# EAGLE design axiom_beta_center_solder_on_v0.1 (EAGLE 7.0.0)
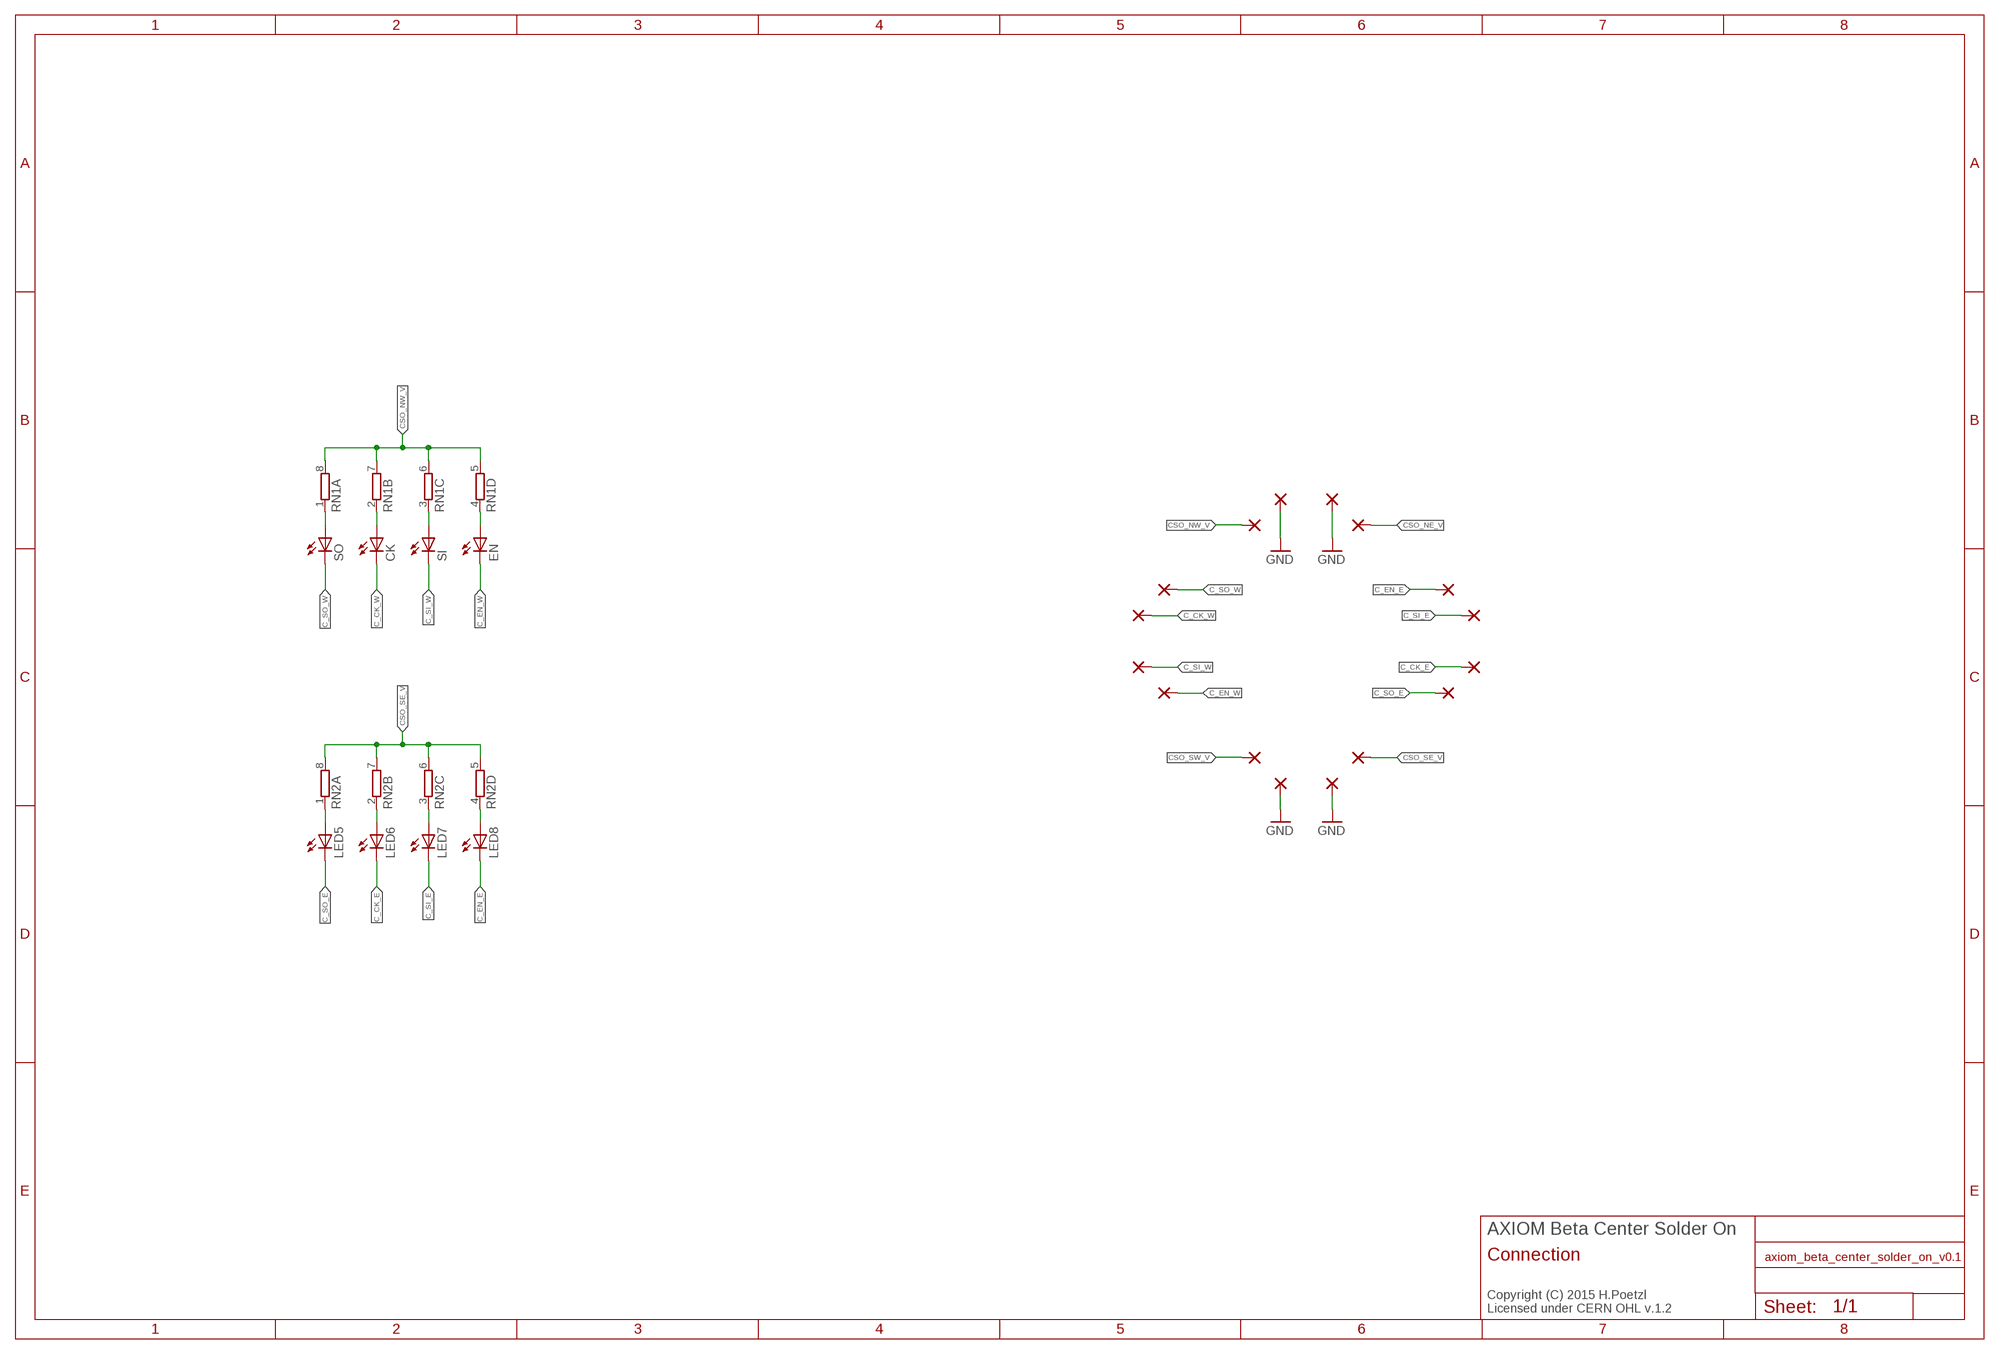
[diagram p0: schematic, sheet 1]

## Parts
CK  LEDCHIPLED_0603  [CHIPLED_0603]
EN  LEDCHIPLED_0603  [CHIPLED_0603]
LED5  LEDCHIPLED_0603  [CHIPLED_0603]
LED6  LEDCHIPLED_0603  [CHIPLED_0603]
LED7  LEDCHIPLED_0603  [CHIPLED_0603]
LED8  LEDCHIPLED_0603  [CHIPLED_0603]
RN1  4R-NCAT16  [CAT16]
RN2  4R-NCAT16  [CAT16]
SI  LEDCHIPLED_0603  [CHIPLED_0603]
SO  LEDCHIPLED_0603  [CHIPLED_0603]
U$1  PINPAD2.00MM  [1.4/0.8]
U$2  PINPAD2.00MM  [1.4/0.8]
U$3  PINPAD2.00MM  [1.4/0.8]
U$4  PINPAD2.00MM  [1.4/0.8]
U$5  PINPAD2.00MM  [1.4/0.8]
U$6  PINPAD2.00MM  [1.4/0.8]
U$11  PINPAD2.00MM  [1.4/0.8]
U$14  PINPAD2.00MM  [1.4/0.8]
U$15  PINPAD2.00MM  [1.4/0.8]
U$16  PINPAD2.00MM  [1.4/0.8]
U$17  PINPAD2.00MM  [1.4/0.8]
U$18  PINPAD2.00MM  [1.4/0.8]
U$19  PINPAD2.00MM  [1.4/0.8]
U$20  PINPAD2.00MM  [1.4/0.8]
U$21  PINPAD2.00MM  [1.4/0.8]
U$22  PINPAD2.00MM  [1.4/0.8]

## Nets
C_CK_E: LED6.C U$14.1(P)
C_CK_W: CK.C U$1.1(P)
C_EN_E: LED8.C U$3.1(P)
C_EN_W: EN.C U$4.1(P)
C_SI_E: LED7.C U$15.1(P)
C_SI_W: SI.C U$2.1(P)
C_SO_E: LED5.C U$16.1(P)
C_SO_W: SO.C U$11.1(P)
CSO_NE_V [power]: U$19.1(P)
CSO_NW_V: RN1.5 RN1.6 RN1.7 RN1.8 U$18.1(P)
CSO_SE_V: RN2.5 RN2.6 RN2.7 RN2.8 U$21.1(P)
CSO_SW_V [power]: U$22.1(P)
GND: U$5.1(P) U$6.1(P) U$17.1(P) U$20.1(P)
N$1: RN1.1 SO.A
N$5: CK.A RN1.2
N$6: RN1.3 SI.A
N$7: EN.A RN1.4
N$14: LED5.A RN2.1
N$15: LED6.A RN2.2
N$16: LED7.A RN2.3
N$17: LED8.A RN2.4

## Notes on the sheet
- AXIOM Beta Center Solder On
- Connection
- Copyright (C) 2015 H.Poetzl
  Licensed under CERN OHL v.1.2

## Library data of the parts
CK EN LED5-LED8 SI SO = led:LED: LED OSRAM: - CHIPLED LG R971, LG N971, LY N971, LG Q971, LY Q971, LO R971, LY R971 LH N974, LH R974 LS Q976, LO Q976, LY Q976 LO Q996 - Hyper CHIPLED LW Q18S LB Q993, LB Q99A, LB R99A - SideLED LS A670, LO A670, LY A670, LG A670, LP A670 LB A673, LV A673, LT A673, LW A673 LH A674 LY A675 LS A676, LA A676, LO A676, LY A676, LW A676 LS A679, LY A679, LG A679 - Hyper Micro SIDELED® LS Y876, LA Y876, LO Y876, LY Y876 LT Y87S - SmartLED LW L88C, LW L88S LB L89C, LB L89S, LG L890 LS L89K, LO L89K, LY L89K LS L896, LA L896, LO L896, LY L896 - TOPLED LS T670, LO T670, LY T670, LG T670, LP T670 LSG T670, LSP T670, LSY T670, LOP T670, LYG T670 LG T671, LOG T671, LSG T671 LB T673, LV T673, LT T673, LW T673 LH T674 LS T676, LA T676, LO T676, LY T676, LB T676, LH T676, LSB T676, LW T676 LB T67C, LV T67C, LT T67C, LS T67K, LO T67K, LY T67K, LW E67C LS E67B, LA E67B, LO E67B, LY E67B, LB E67C, LV E67C, LT E67C LW T67C LS T679, LY T679, LG T679 LS T770, LO T770, LY T770, LG T770, LP T770 LB T773, LV T773, LT T773, LW T773 LH T774 LS E675, LA E675, LY E675, LS T675 LS T776, LA T776, LO T776, LY T776, LB T776 LHGB T686 LT T68C, LB T68C - Hyper Mini TOPLED® LB M676 - Mini TOPLED Santana® LG M470 LS M47K, LO M47K, LY M47K Source: http://www.osram.convergy.de LUXEON: - LUMILED® LXK2-PW12-R00, LXK2-PW12-S00, LXK2-PW14-U00, LXK2-PW14-V00 LXK2-PM12-R00, LXK2-PM12-S00, LXK2-PM14-U00 LXK2-PE12-Q00, LXK2-PE12-R00, LXK2-PE12-S00, LXK2-PE14-T00, LXK2-PE14-U00 LXK2-PB12-K00, LXK2-PB12-L00, LXK2-PB12-M00, LXK2-PB14-N00, LXK2-PB14-P00, LXK2-PB14-Q00 LXK2-PR12-L00, LXK2-PR12-M00, LXK2-PR14-Q00, LXK2-PR14-R00 LXK2-PD12-Q00, LXK2-PD12-R00, LXK2-PD12-S00 LXK2-PH12-R00, LXK2-PH12-S00 LXK2-PL12-P00, LXK2-PL12-Q00, LXK2-PL12-R00 Source: www.luxeon.com KINGBRIGHT: KA-3528ASYC Source: www.kingbright.com
RN1 RN2 = resistor-dil:4R-N: Array Chip Resistor Source: RS Component / Phycomp; OC_FARNELL: unknown; OC_NEWARK: unknown
U$1-U$6 U$11 U$14-U$22 = pinpad:PINPAD

## Net classes
0 default: width 0.152 mm, drill 0.254 mm
1 power: width 0.152 mm, drill 0.254 mm

## Board
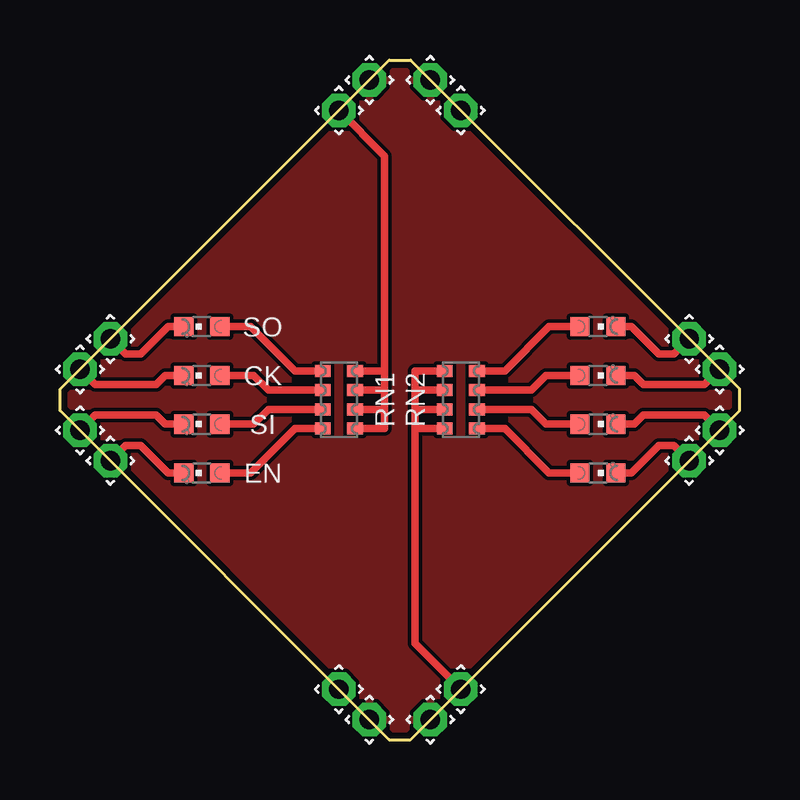
[diagram p1: board, top side]
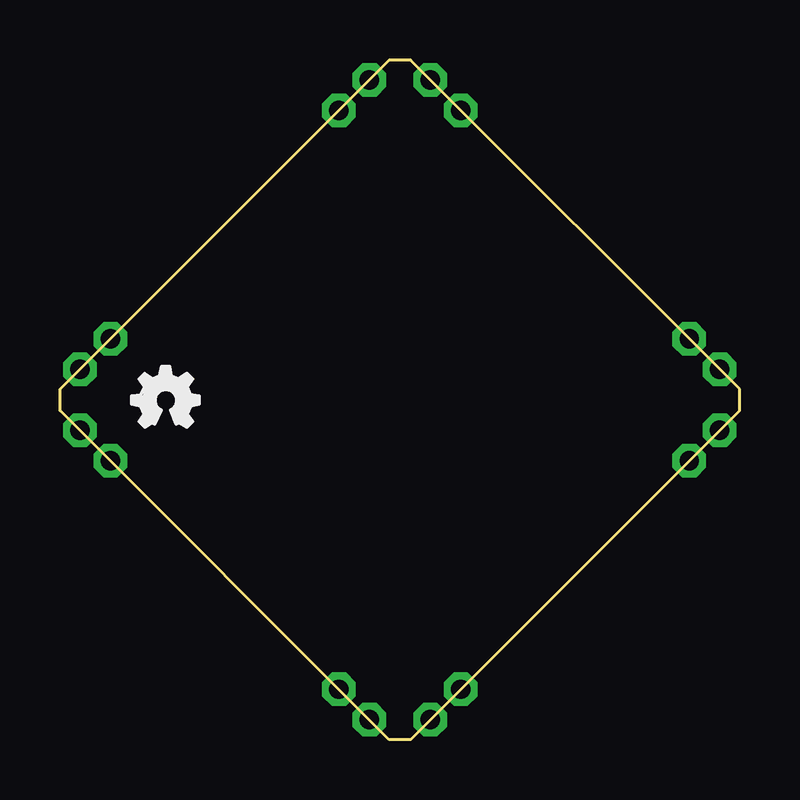
[diagram p2: board, bottom side, seen from below]

Size 28.34 x 28.34 mm. Coordinates in mm from the lower left corner, seen from the top.
Outline: 0,13.72 13.72,0 14.62,0 28.34,13.72 28.34,14.62 14.62,28.34 13.72,28.34 0,14.62 0,13.72
Copper layers (1*2*15*16): Top 0.035559375mm / dielectric 0.17018125mm / Route2 0.01778125mm / dielectric 47mil / Route15 0.01778125mm / dielectric 0.17018125mm / Bottom 0.035559375mm
Design rules "OSHPark-4layer-tuned *": minimum track width 5mil, minimum drill 10mil, track to track 6mil, track to pad 5mil, pad to pad 5mil, via to via 5mil, smd to smd 5mil, copper to edge 10mil, drill to drill 6mil, minimum pad ring 4mil, minimum via ring 4mil, stop-mask expansion 2mil, vias tented up to drill 100mil, thermal gap 6mil

### Footprints (pad centres in the part's own frame; a part is rotated, then mirrored left to right if it is on the bottom)
CHIPLED_0603 = smd 0.8 x 0.8: A 0,-0.75; C 0,0.75
CAT16 = smd 0.5 x 0.65: 1 -1.2,-0.675; 2 -0.4,-0.675; 3 0.4,-0.675; 4 1.2,-0.675; 5 1.2,0.675; 6 0.4,0.675; 7 -0.4,0.675; 8 -1.2,0.675
1.4/0.8 = drill 0.8 pad 1.4 octagon: 1 0,0

### Placement (x,y rotation side)
CK  5.91,15.18 90 top
EN  5.91,11.12 90 top
LED5  22.42,11.12 270 top
LED6  22.42,13.15 270 top
LED7  22.42,15.18 270 top
LED8  22.42,17.22 270 top
LOGO1  OSHW_LOGO_FILLX0100-NT  [OSHW_FILLX100_NOTEXT]  25.34,13.03 0 bottom
RN1  11.63,14.17 270 top
RN2  16.71,14.17 90 top
SI  5.91,13.15 90 top
SO  5.91,17.22 90 top
U$1  0.83,15.44 45 top
U$2  0.83,12.9 45 top
U$3  26.23,16.71 45 top
U$4  2.1,11.63 225 top
U$5  15.44,0.83 45 top
U$6  15.44,27.5 45 top
U$11  2.1,16.71 45 top
U$14  27.5,12.9 45 top
U$15  27.5,15.44 45 top
U$16  26.23,11.63 45 top
U$17  12.9,27.5 45 top
U$18  11.63,26.23 45 top
U$19  16.71,26.23 45 top
U$20  12.9,0.83 45 top
U$21  16.71,2.1 45 top
U$22  11.63,2.1 45 top

### Tracks (layer width: path | path; a pad name or v marks a point on that pad's centre or on a via)
C_CK_E
  Top 0.305: U$14.1 26.87,13.53 24.33,13.53 23.95,13.15 LED6.C
C_CK_W
  Top 0.305: U$1.1 1.47,14.8 4.01,14.8 4.39,15.18 CK.C
C_EN_E
  Top 0.305: U$3.1 25.6,16.07 24.96,16.07 23.82,17.22 LED8.C
C_EN_W
  Top 0.305: U$4.1 2.74,12.26 3.37,12.26 4.52,11.12 EN.C
C_SI_E
  Top 0.305: U$15.1 26.87,14.8 24.33,14.8 23.95,15.18 LED7.C
C_SI_W
  Top 0.305: U$2.1 1.47,13.53 4.01,13.53 4.39,13.15 SI.C
C_SO_E
  Top 0.305: U$16.1 25.6,12.26 24.96,12.26 23.82,11.12 LED5.C
C_SO_W
  Top 0.305: U$11.1 2.74,16.07 3.37,16.07 4.52,17.22 SO.C
CSO_NW_V
  Top 0.305: RN1.5 13.53,12.97 13.53,13.77 | 13.53,14.57 13.53,15.37 | 13.53,15.37 RN1.8 | RN1.7 13.53,14.57 | 13.53,14.57 13.53,13.77 | RN1.6 13.53,13.77 | 13.53,15.37 13.53,24.33 U$18.1
CSO_SE_V
  Top 0.305: RN2.8 14.8,12.97 | 14.8,12.97 14.8,13.77 | 14.8,14.57 14.8,15.37 RN2.5 | RN2.6 14.8,14.57 | 14.8,14.57 14.8,13.77 | RN2.7 14.8,13.77 | 14.8,12.97 14.8,4.01 U$21.1
GND
  pour Top: -0.44,14.17 14.17,28.77 28.77,14.17 14.17,-0.44
N$1
  Top 0.305: SO.A 7.95,17.22 9.79,15.37 RN1.1
N$5
  Top 0.305: CK.A 8.07,15.18 8.69,14.57 RN1.2
N$6
  Top 0.305: SI.A 8.07,13.15 8.69,13.77 RN1.3
N$7
  Top 0.305: EN.A 7.95,11.12 9.79,12.97 RN1.4
N$14
  Top 0.305: LED5.A 20.39,11.12 18.54,12.97 RN2.1
N$15
  Top 0.305: LED6.A 20.26,13.15 19.65,13.77 RN2.2
N$16
  Top 0.305: LED7.A 20.26,15.18 19.65,14.57 RN2.3
N$17
  Top 0.305: LED8.A 20.39,17.22 18.54,15.37 RN2.4

### Text on the board
_tSilk: EN | SI | CK | SO
_bSilk: Debug / Center Solder On | Copyright (C) 2016 Herbert Pötzl / Licensed under CERN OHL v.1.2 | V0.1 / R1.0